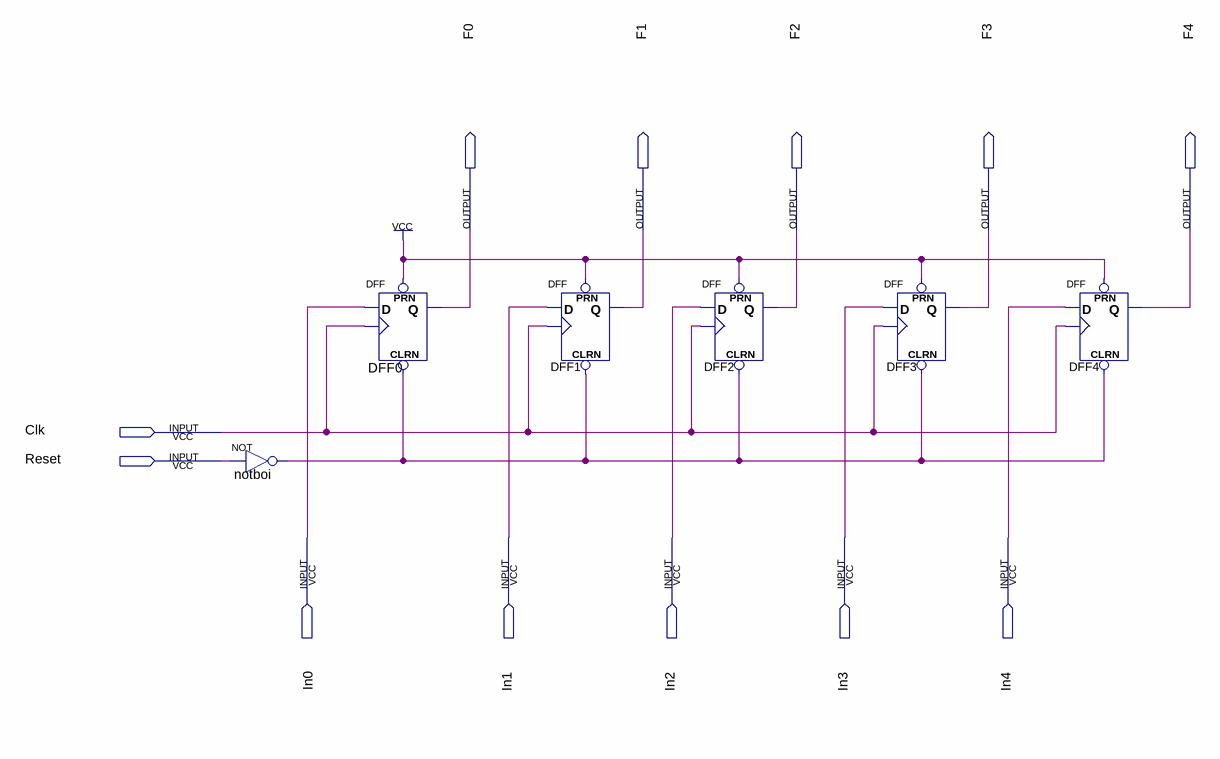
[diagram p0: schematic sheet]
// Quartus schematic 5BitRegister.bdf as structural Verilog: 6 symbols, 12 pins
module \5BitRegister  (
  input  Clk,
  input  Reset,
  input  In0,
  input  In1,
  input  In2,
  input  In3,
  input  In4,
  output F0,
  output F1,
  output F2,
  output F3,
  output F4
);

  wire notboi_out;

  not notboi (notboi_out, Reset);
  DFF DFF0 (.CLRN(notboi_out), .CLK(Clk), .D(In0), .PRN(1'b1), .Q(F0));
  DFF DFF1 (.CLRN(notboi_out), .CLK(Clk), .D(In1), .PRN(1'b1), .Q(F1));
  DFF DFF2 (.CLRN(notboi_out), .CLK(Clk), .D(In2), .PRN(1'b1), .Q(F2));
  DFF DFF3 (.CLRN(notboi_out), .CLK(Clk), .D(In3), .PRN(1'b1), .Q(F3));
  DFF DFF4 (.CLRN(notboi_out), .CLK(Clk), .D(In4), .PRN(1'b1), .Q(F4));
endmodule
